# EAGLE design v4.0 (EAGLE 9.4.2)
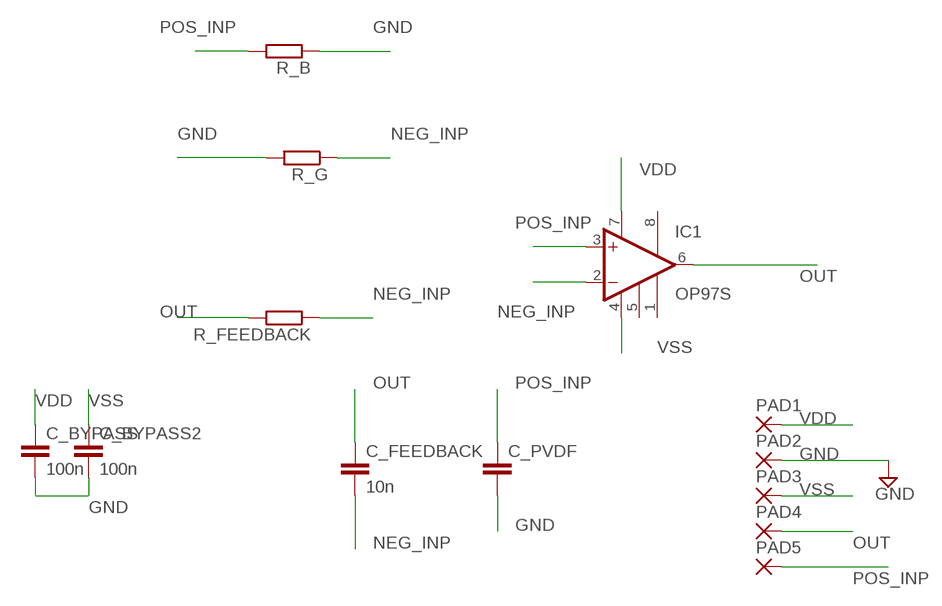
[diagram p0: schematic, sheet 1]

## Parts
C_BYPASS  100n  C-EUC0805  [C0805]
C_BYPASS2  100n  C-EUC0805  [C0805]
C_FEEDBACK  10n  C-EUC0805  [C0805]
C_PVDF  C-EUC0805  [C0805]
IC1  OP97S  [SO08]
PAD1  SMD5  [SMD2,54-5,08]
PAD2  SMD5  [SMD2,54-5,08]
PAD3  SMD5  [SMD2,54-5,08]
PAD4  SMD5  [SMD2,54-5,08]
PAD5  SMD5  [SMD2,54-5,08]
R_B  100M  R-EU_M0805  [M0805]
R_FEEDBACK  200k  R-EU_M0805  [M0805]
R_G  10k  R-EU_M0805  [M0805]

## Nets
GND: C_BYPASS2.2 C_BYPASS.2 C_PVDF.2 PAD2.1(P) R_B.1 R_G.2
NEG_INP: C_FEEDBACK.2 IC1.2(-IN) R_FEEDBACK.1 R_G.1
OUT: C_FEEDBACK.1 IC1.6(OUT) PAD4.1(P) R_FEEDBACK.2
POS_INP: C_PVDF.1 IC1.3(+IN) PAD5.1(P) R_B.2
VDD: C_BYPASS.1 IC1.7(V+) PAD1.1(P)
VSS: C_BYPASS2.1 IC1.4(V-) PAD3.1(P)
Unconnected: IC1.1(BAL1) IC1.5(COMP) IC1.8(BAL2)

## Library data of the parts
C_BYPASS C_BYPASS2 = resistor:C-EU: CAPACITOR, European symbol
C_FEEDBACK C_PVDF = rcl:C-EU: CAPACITOR, European symbol; SPICEPREFIX: C
IC1 = linear:OP97: Low Power, High Precision Operational Amplifier Source: http://www.analog.com/static/imported-files/data_sheets/OP97.pdf
PAD1-PAD5 = wirepad:SMD5: SMD PAD
R_B R_FEEDBACK R_G = rcl:R-EU_: RESISTOR, European symbol; SPICEPREFIX: R

## Board
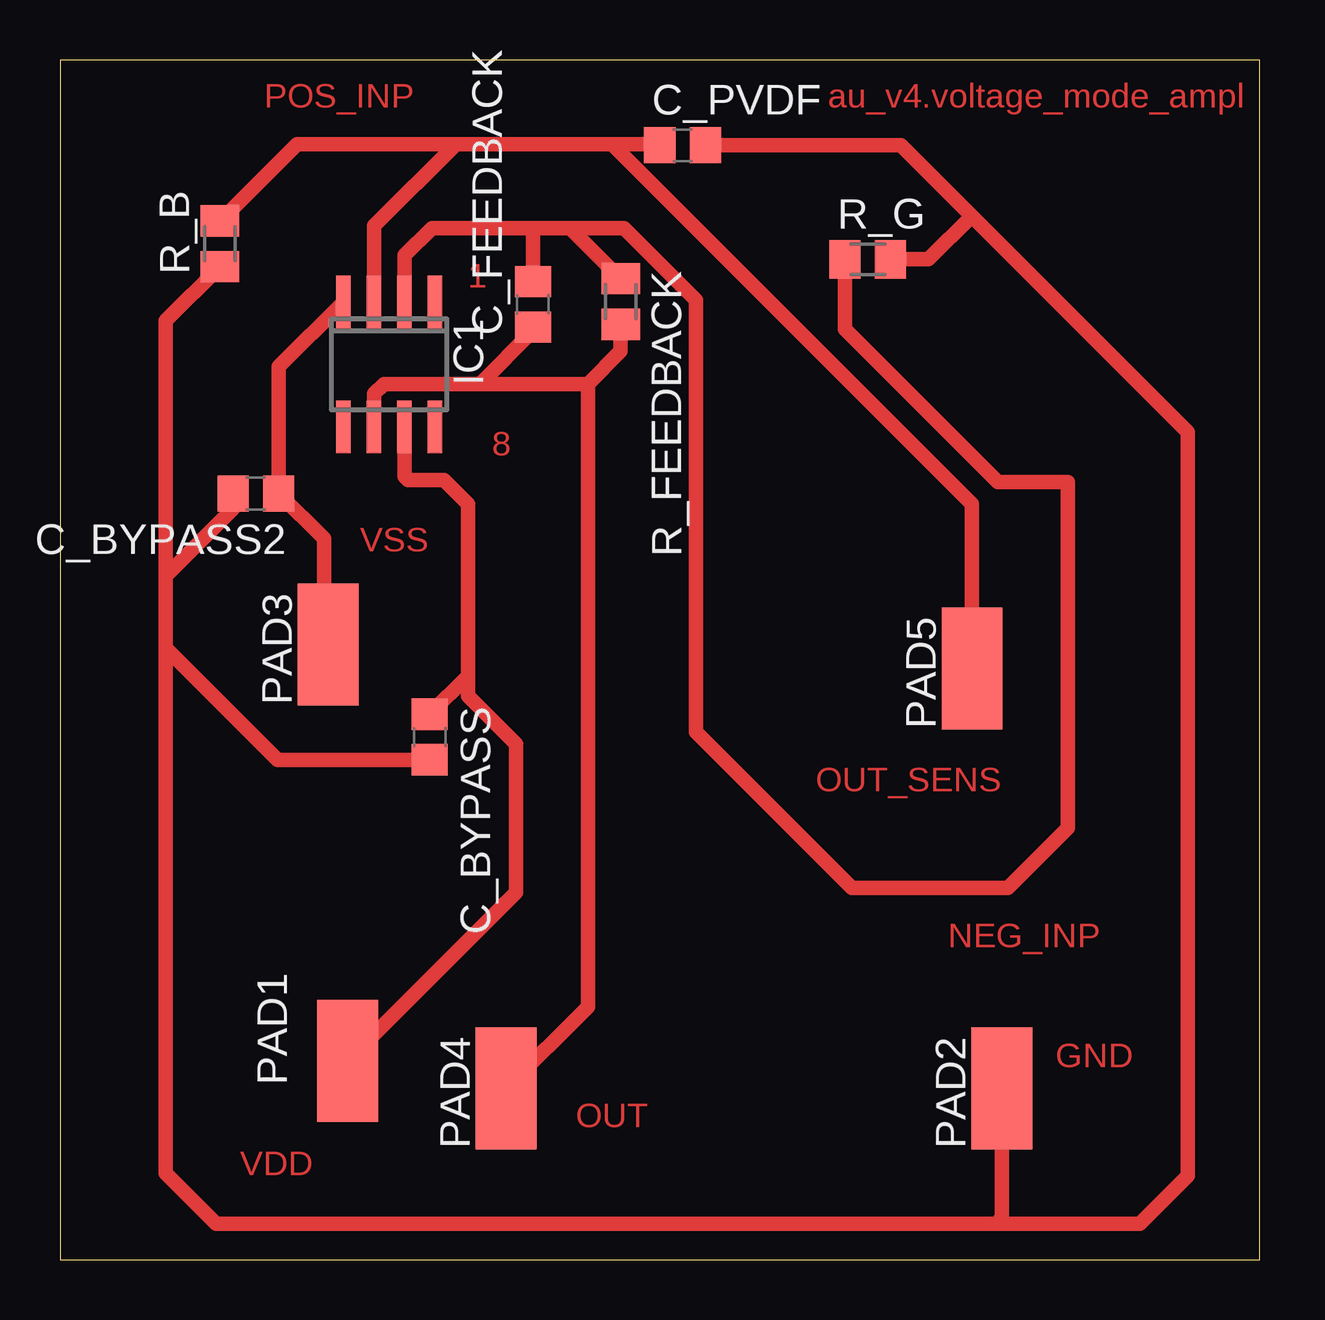
[diagram p1: board, top side]

Size 50 x 50 mm. Coordinates in mm from the lower left corner, seen from the top.
Outline: 0,0 50,0 50,50 0,50 0,0
Copper layers (1*16): Top 0.035mm / dielectric 1.5mm / Bottom 0.035mm
Design rules "TM_medit_aetzen": minimum track width 10mil, minimum drill 8mil, track to track 10mil, track to pad 10mil, pad to pad 10mil, via to via 15mil, smd to smd 8mil, copper to edge 40mil, drill to drill 8mil, minimum pad ring 10mil, minimum via ring 8mil, stop-mask expansion 4mil, vias tented up to drill 0mil, thermal gap 10mil

### Footprints (pad centres in the part's own frame; a part is rotated, then mirrored left to right if it is on the bottom)
C0805 = smd 1.3 x 1.5: 1 -0.95,0; 2 0.95,0
SO08 = smd 0.6 x 2.2: 1 -1.905,-2.6; 2 -0.635,-2.6; 3 0.635,-2.6; 4 1.905,-2.6; 5 1.905,2.6; 6 0.635,2.6; 7 -0.635,2.6; 8 -1.905,2.6
SMD2,54-5,08 = smd 2.54 x 5.08: 1 0,0
M0805 = smd 1.3 x 1.6: 1 -0.95,0; 2 0.95,0

### Placement (x,y rotation side)
C_BYPASS  15.41,21.78 270 top
C_BYPASS2  8.17,31.93 180 top
C_FEEDBACK  19.71,39.81 90 top
C_PVDF  25.95,46.44 0 top
IC1  13.72,37.31 180 top
PAD1  11.98,8.28 0 top
PAD2  39.26,7.13 0 top
PAD3  11.18,25.63 0 top
PAD4  18.6,7.13 0 top
PAD5  38.02,24.63 0 top
R_B  6.67,42.34 90 top
R_FEEDBACK  23.37,39.93 270 top
R_G  33.67,41.69 0 top

### Tracks (layer width: path | path; a pad name or v marks a point on that pad's centre or on a via)
GND
  Top 0.61: 38,43.5 47,34.5 47,3.5 45,1.5 39,1.5 | 38,43.5 35.06,46.44 C_PVDF.2 | 39,1.5 10.5,1.5 10,1.5 6.5,1.5 4.41,3.59 4.41,25.5 | R_G.2 36.19,41.69 38,43.5 | 4.41,25.5 4.41,28.5 | 4.41,28.5 4.41,39.13 R_B.1 | 4.41,25.5 9.08,20.83 C_BYPASS.2 | C_BYPASS2.2 7.22,31.31 4.41,28.5 | PAD2.1 39.26,1.76 39,1.5
NEG_INP
  Top 0.61: IC1.2 14.36,41.85 15.5,43 19.5,43 | 19.5,43 19.71,42.79 C_FEEDBACK.2 | 19.5,43 21.25,43 | R_FEEDBACK.1 21.25,43 | 21.25,43 23.5,43 26.5,40 26.5,22 33,15.5 39.5,15.5 42,18 42,32.41 39.09,32.41 32.72,38.78 R_G.1
OUT
  Top 0.61: IC1.6 13.09,36.09 13.5,36.5 17.5,36.5 | 17.5,36.5 22,36.5 | 17.5,36.5 19.71,38.71 C_FEEDBACK.1 | 22,36.5 23.37,37.87 R_FEEDBACK.2 | PAD4.1 22,10.53 22,36.5
POS_INP
  Top 0.61: IC1.3 13.09,43.09 16.5,46.5 | 16.5,46.5 23,46.5 | 23,46.5 24.94,46.5 C_PVDF.1 | R_B.2 9.88,46.5 16.5,46.5 | 23,46.5 38,31.5 38,24.65 PAD5.1
VDD
  Top 0.61: C_BYPASS.1 17,24.32 | 17,24.32 17,25 17,31.5 16,32.5 14.5,32.5 14.36,32.65 IC1.7 | 17,24.32 17,23.5 19,21.5 19,15.3 PAD1.1
VSS
  Top 0.61: IC1.4 9.12,37.22 C_BYPASS2.1 11,30.05 11,29.5 11,26.5 11,25.81 PAD3.1

### Text on the board
Top: POS_INP | au_v4.voltage_mode_ampl | 1 | 8 | VSS | OUT_SENS | NEG_INP | GND | OUT | VDD